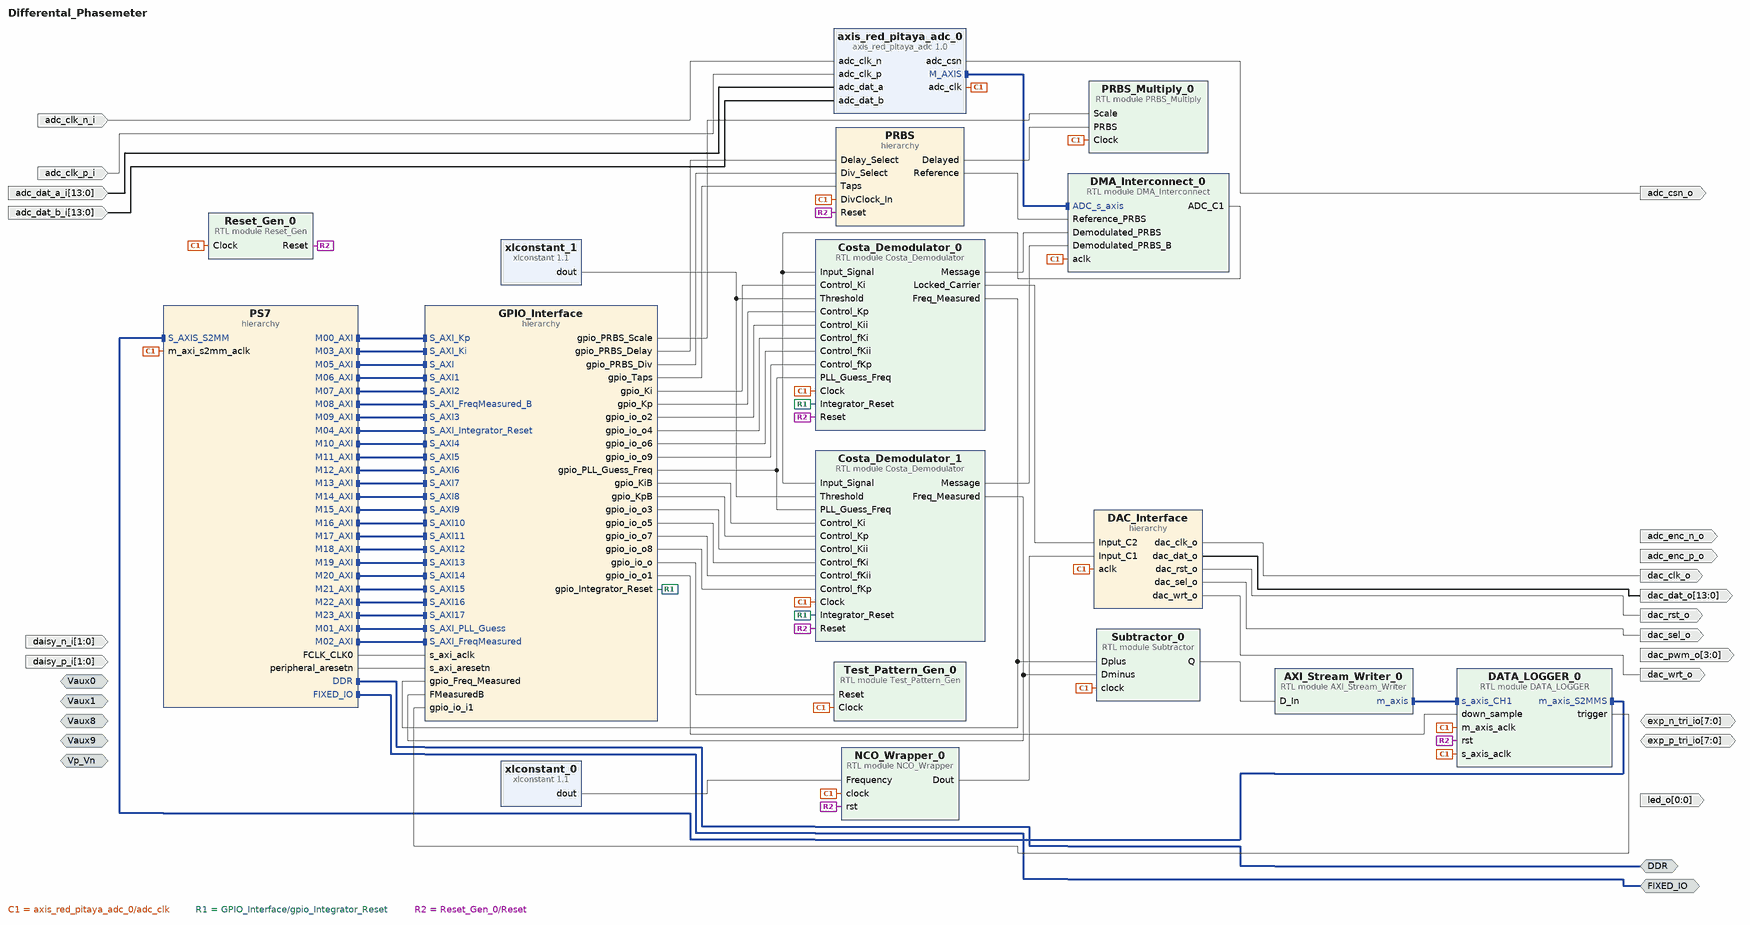
[diagram p0: block diagram of the top level]
# Vivado block design Differental_Phasemeter, xc7z010clg400-1, Vivado 2022.2
create_bd_design Differental_Phasemeter

create_bd_intf_port -mode Slave -vlnv xilinx.com:interface:diff_analog_io_rtl:1.0 Vaux0
create_bd_intf_port -mode Slave -vlnv xilinx.com:interface:diff_analog_io_rtl:1.0 Vaux1
create_bd_intf_port -mode Slave -vlnv xilinx.com:interface:diff_analog_io_rtl:1.0 Vaux8
create_bd_intf_port -mode Slave -vlnv xilinx.com:interface:diff_analog_io_rtl:1.0 Vaux9
create_bd_intf_port -mode Slave -vlnv xilinx.com:interface:diff_analog_io_rtl:1.0 Vp_Vn
create_bd_intf_port -mode Master -vlnv xilinx.com:interface:ddrx_rtl:1.0 DDR
create_bd_intf_port -mode Master -vlnv xilinx.com:display_processing_system7:fixedio_rtl:1.0 FIXED_IO
create_bd_port -dir I adc_clk_n_i
create_bd_port -dir I adc_clk_p_i
create_bd_port -dir I -from 13 -to 0 adc_dat_a_i
create_bd_port -dir I -from 13 -to 0 adc_dat_b_i
create_bd_port -dir I -from 1 -to 0 daisy_n_i
create_bd_port -dir I -from 1 -to 0 daisy_p_i
create_bd_port -dir O adc_csn_o
create_bd_port -dir O adc_enc_n_o
create_bd_port -dir O adc_enc_p_o
create_bd_port -dir O -from 3 -to 0 dac_pwm_o
create_bd_port -dir IO -from 7 -to 0 exp_n_tri_io
create_bd_port -dir IO -from 7 -to 0 exp_p_tri_io
create_bd_port -dir O -from 0 -to 0 led_o
create_bd_port -dir O dac_clk_o
create_bd_port -dir O -from 13 -to 0 dac_dat_o
create_bd_port -dir O dac_rst_o
create_bd_port -dir O dac_sel_o
create_bd_port -dir O dac_wrt_o

create_bd_cell -type ip -vlnv pavel-demin:user:axis_red_pitaya_adc:1.0 axis_red_pitaya_adc_0
create_bd_cell -type hier DAC_Interface
create_bd_cell -type hier GPIO_Interface
create_bd_cell -type hier PS7
create_bd_cell -type hier PRBS
create_bd_cell -type module -reference DMA_Interconnect DMA_Interconnect_0
create_bd_cell -type module -reference AXI_Stream_Writer AXI_Stream_Writer_0
create_bd_cell -type module -reference PRBS_Multiply PRBS_Multiply_0
create_bd_cell -type module -reference Reset_Gen Reset_Gen_0
create_bd_cell -type module -reference Test_Pattern_Gen Test_Pattern_Gen_0
create_bd_cell -type module -reference DATA_LOGGER DATA_LOGGER_0
set_property -dict {CONFIG.DMA_BUFFER 36864 CONFIG.VAR_DS 1} [get_bd_cells DATA_LOGGER_0]
create_bd_cell -type ip -vlnv xilinx.com:ip:xlconstant:1.1 xlconstant_0
set_property -dict {CONFIG.CONST_VAL 343597384 CONFIG.CONST_WIDTH 32} [get_bd_cells xlconstant_0]
create_bd_cell -type ip -vlnv xilinx.com:ip:xlconstant:1.1 xlconstant_1
set_property -dict {CONFIG.CONST_VAL 1 CONFIG.CONST_WIDTH 26} [get_bd_cells xlconstant_1]
create_bd_cell -type module -reference Costa_Demodulator Costa_Demodulator_0
set_property -dict {CONFIG.RAM_Size 14} [get_bd_cells Costa_Demodulator_0]
create_bd_cell -type module -reference Costa_Demodulator Costa_Demodulator_1
set_property -dict {CONFIG.RAM_Size 14} [get_bd_cells Costa_Demodulator_1]
create_bd_cell -type module -reference Subtractor Subtractor_0
create_bd_cell -type module -reference NCO_Wrapper NCO_Wrapper_0
set_property -dict {CONFIG.DAC_SIZE 14 CONFIG.ROM_Size 12} [get_bd_cells NCO_Wrapper_0]

# ---- hierarchy /DAC_Interface ----
current_bd_instance /DAC_Interface
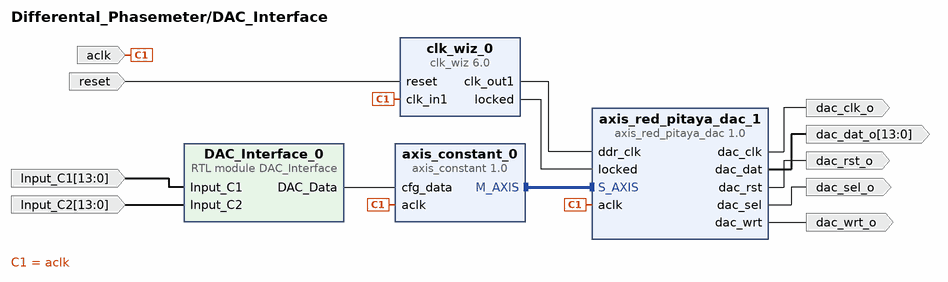
[diagram p1: block diagram inside /DAC_Interface]
create_bd_pin -dir I -type clk aclk
create_bd_pin -dir I -type rst reset
create_bd_pin -dir O -type clk dac_clk_o
create_bd_pin -dir O -type rst dac_rst_o
create_bd_pin -dir O dac_sel_o
create_bd_pin -dir O dac_wrt_o
create_bd_pin -dir O -from 13 -to 0 dac_dat_o
create_bd_pin -dir I -from 13 -to 0 Input_C2
create_bd_pin -dir I -from 13 -to 0 Input_C1

create_bd_cell -type ip -vlnv pavel-demin:user:axis_constant:1.0 axis_constant_0
set_property -dict {CONFIG.AXIS_TDATA_WIDTH 32} [get_bd_cells axis_constant_0]
create_bd_cell -type ip -vlnv xilinx.com:ip:clk_wiz:6.0 clk_wiz_0
set_property -dict [list \
  CONFIG.CLKOUT1_JITTER 104.759 \
  CONFIG.CLKOUT1_REQUESTED_OUT_FREQ 250 \
  CONFIG.MMCM_CLKOUT0_DIVIDE_F 4.000 \
] [get_bd_cells clk_wiz_0]
create_bd_cell -type ip -vlnv pavel-demin:user:axis_red_pitaya_dac:1.0 axis_red_pitaya_dac_1
create_bd_cell -type module -reference DAC_Interface DAC_Interface_0

# ---- hierarchy /GPIO_Interface ----
current_bd_instance /GPIO_Interface
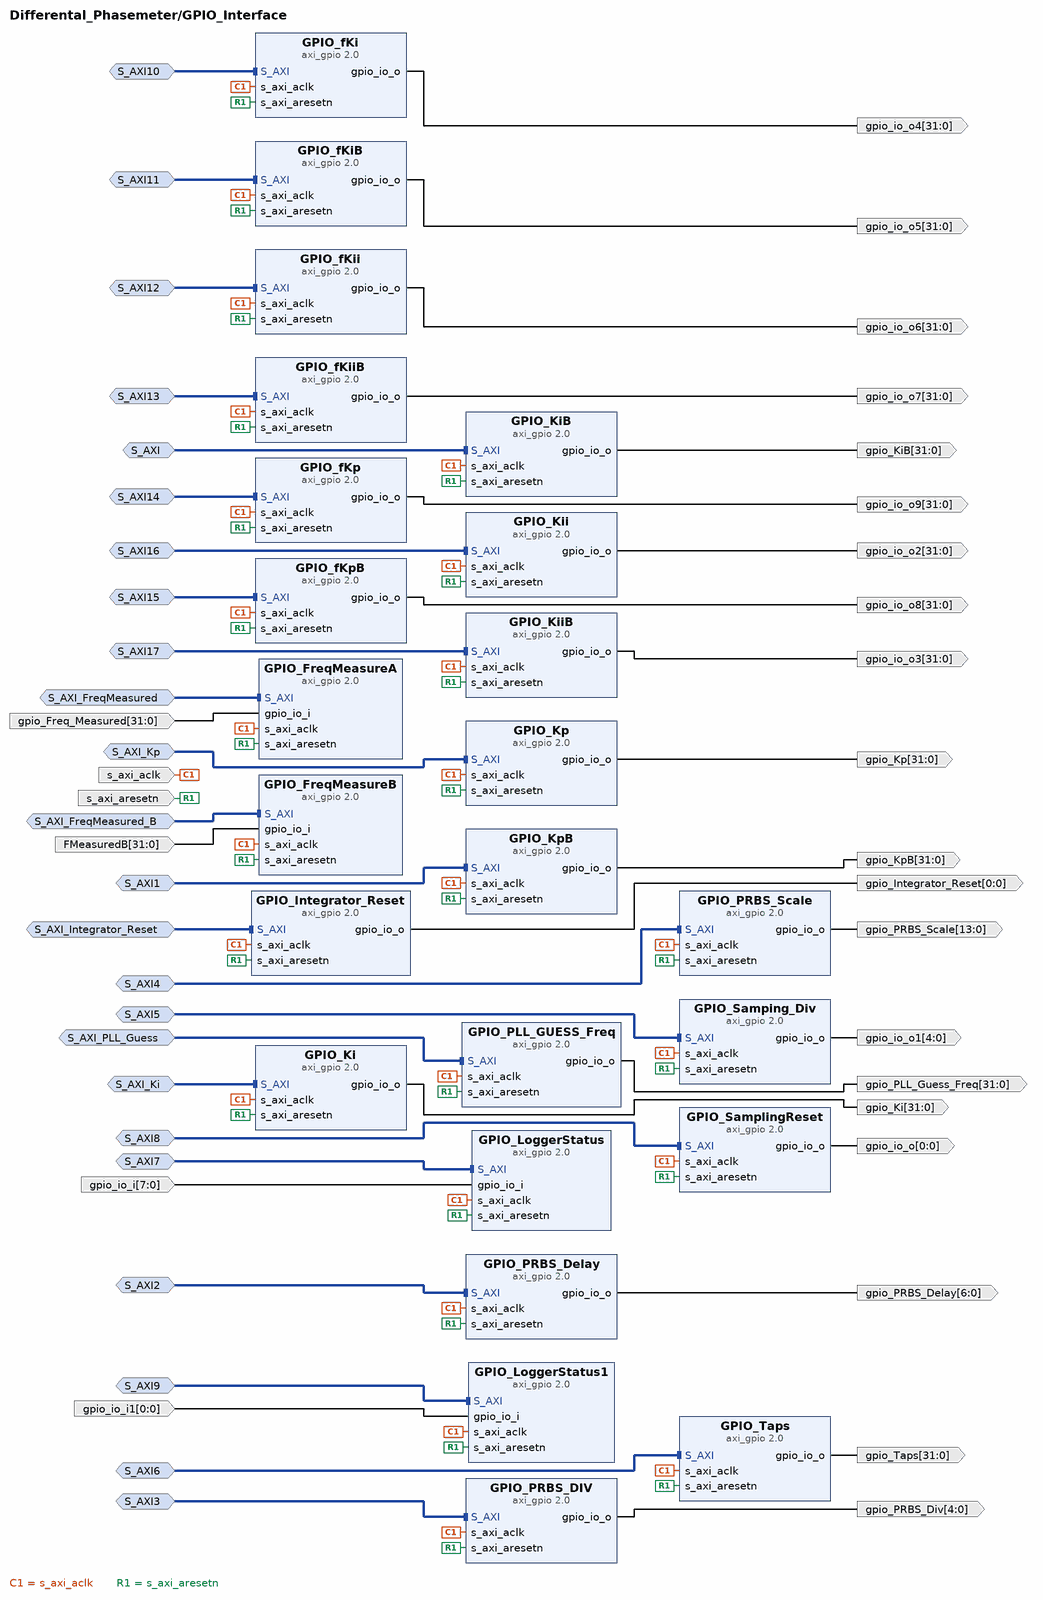
[diagram p2: block diagram inside /GPIO_Interface]
create_bd_intf_pin -mode Slave -vlnv xilinx.com:interface:aximm_rtl:1.0 S_AXI_Ki
create_bd_intf_pin -mode Slave -vlnv xilinx.com:interface:aximm_rtl:1.0 S_AXI_Kp
create_bd_intf_pin -mode Slave -vlnv xilinx.com:interface:aximm_rtl:1.0 S_AXI_PLL_Guess
create_bd_intf_pin -mode Slave -vlnv xilinx.com:interface:aximm_rtl:1.0 S_AXI_FreqMeasured
create_bd_intf_pin -mode Slave -vlnv xilinx.com:interface:aximm_rtl:1.0 S_AXI_Integrator_Reset
create_bd_intf_pin -mode Slave -vlnv xilinx.com:interface:aximm_rtl:1.0 S_AXI_FreqMeasured_B
create_bd_intf_pin -mode Slave -vlnv xilinx.com:interface:aximm_rtl:1.0 S_AXI
create_bd_intf_pin -mode Slave -vlnv xilinx.com:interface:aximm_rtl:1.0 S_AXI1
create_bd_intf_pin -mode Slave -vlnv xilinx.com:interface:aximm_rtl:1.0 S_AXI2
create_bd_intf_pin -mode Slave -vlnv xilinx.com:interface:aximm_rtl:1.0 S_AXI3
create_bd_intf_pin -mode Slave -vlnv xilinx.com:interface:aximm_rtl:1.0 S_AXI4
create_bd_intf_pin -mode Slave -vlnv xilinx.com:interface:aximm_rtl:1.0 S_AXI5
create_bd_intf_pin -mode Slave -vlnv xilinx.com:interface:aximm_rtl:1.0 S_AXI6
create_bd_intf_pin -mode Slave -vlnv xilinx.com:interface:aximm_rtl:1.0 S_AXI7
create_bd_intf_pin -mode Slave -vlnv xilinx.com:interface:aximm_rtl:1.0 S_AXI8
create_bd_intf_pin -mode Slave -vlnv xilinx.com:interface:aximm_rtl:1.0 S_AXI9
create_bd_intf_pin -mode Slave -vlnv xilinx.com:interface:aximm_rtl:1.0 S_AXI10
create_bd_intf_pin -mode Slave -vlnv xilinx.com:interface:aximm_rtl:1.0 S_AXI11
create_bd_intf_pin -mode Slave -vlnv xilinx.com:interface:aximm_rtl:1.0 S_AXI12
create_bd_intf_pin -mode Slave -vlnv xilinx.com:interface:aximm_rtl:1.0 S_AXI13
create_bd_intf_pin -mode Slave -vlnv xilinx.com:interface:aximm_rtl:1.0 S_AXI14
create_bd_intf_pin -mode Slave -vlnv xilinx.com:interface:aximm_rtl:1.0 S_AXI15
create_bd_intf_pin -mode Slave -vlnv xilinx.com:interface:aximm_rtl:1.0 S_AXI16
create_bd_intf_pin -mode Slave -vlnv xilinx.com:interface:aximm_rtl:1.0 S_AXI17
create_bd_pin -dir O -from 31 -to 0 gpio_Ki
create_bd_pin -dir O -from 31 -to 0 gpio_Kp
create_bd_pin -dir O -from 31 -to 0 gpio_PLL_Guess_Freq
create_bd_pin -dir I -type clk s_axi_aclk
create_bd_pin -dir I -type rst s_axi_aresetn
create_bd_pin -dir I -from 31 -to 0 gpio_Freq_Measured
create_bd_pin -dir O -from 0 -to 0 gpio_Integrator_Reset
create_bd_pin -dir I -from 31 -to 0 FMeasuredB
create_bd_pin -dir O -from 31 -to 0 gpio_KiB
create_bd_pin -dir O -from 31 -to 0 gpio_KpB
create_bd_pin -dir O -from 13 -to 0 gpio_PRBS_Scale
create_bd_pin -dir O -from 6 -to 0 gpio_PRBS_Delay
create_bd_pin -dir O -from 4 -to 0 gpio_PRBS_Div
create_bd_pin -dir O -from 31 -to 0 gpio_Taps
create_bd_pin -dir O -from 0 -to 0 gpio_io_o
create_bd_pin -dir O -from 4 -to 0 gpio_io_o1
create_bd_pin -dir I -from 7 -to 0 gpio_io_i
create_bd_pin -dir I -from 0 -to 0 gpio_io_i1
create_bd_pin -dir O -from 31 -to 0 gpio_io_o2
create_bd_pin -dir O -from 31 -to 0 gpio_io_o3
create_bd_pin -dir O -from 31 -to 0 gpio_io_o4
create_bd_pin -dir O -from 31 -to 0 gpio_io_o5
create_bd_pin -dir O -from 31 -to 0 gpio_io_o6
create_bd_pin -dir O -from 31 -to 0 gpio_io_o7
create_bd_pin -dir O -from 31 -to 0 gpio_io_o8
create_bd_pin -dir O -from 31 -to 0 gpio_io_o9

create_bd_cell -type ip -vlnv xilinx.com:ip:axi_gpio:2.0 GPIO_Ki
set_property -dict {CONFIG.C_ALL_OUTPUTS 1} [get_bd_cells GPIO_Ki]
create_bd_cell -type ip -vlnv xilinx.com:ip:axi_gpio:2.0 GPIO_Kp
set_property -dict {CONFIG.C_ALL_OUTPUTS 1} [get_bd_cells GPIO_Kp]
create_bd_cell -type ip -vlnv xilinx.com:ip:axi_gpio:2.0 GPIO_PLL_GUESS_Freq
set_property -dict {CONFIG.C_ALL_OUTPUTS 1} [get_bd_cells GPIO_PLL_GUESS_Freq]
create_bd_cell -type ip -vlnv xilinx.com:ip:axi_gpio:2.0 GPIO_FreqMeasureA
set_property -dict {CONFIG.C_ALL_INPUTS 1} [get_bd_cells GPIO_FreqMeasureA]
create_bd_cell -type ip -vlnv xilinx.com:ip:axi_gpio:2.0 GPIO_Integrator_Reset
set_property -dict {CONFIG.C_ALL_OUTPUTS 1 CONFIG.C_GPIO_WIDTH 1} [get_bd_cells GPIO_Integrator_Reset]
create_bd_cell -type ip -vlnv xilinx.com:ip:axi_gpio:2.0 GPIO_FreqMeasureB
set_property -dict {CONFIG.C_ALL_INPUTS 1} [get_bd_cells GPIO_FreqMeasureB]
create_bd_cell -type ip -vlnv xilinx.com:ip:axi_gpio:2.0 GPIO_KiB
set_property -dict {CONFIG.C_ALL_OUTPUTS 1} [get_bd_cells GPIO_KiB]
create_bd_cell -type ip -vlnv xilinx.com:ip:axi_gpio:2.0 GPIO_KpB
set_property -dict {CONFIG.C_ALL_OUTPUTS 1} [get_bd_cells GPIO_KpB]
create_bd_cell -type ip -vlnv xilinx.com:ip:axi_gpio:2.0 GPIO_PRBS_Scale
set_property -dict {CONFIG.C_ALL_OUTPUTS 1 CONFIG.C_GPIO_WIDTH 14} [get_bd_cells GPIO_PRBS_Scale]
create_bd_cell -type ip -vlnv xilinx.com:ip:axi_gpio:2.0 GPIO_PRBS_DIV
set_property -dict {CONFIG.C_ALL_OUTPUTS 1 CONFIG.C_GPIO_WIDTH 5} [get_bd_cells GPIO_PRBS_DIV]
create_bd_cell -type ip -vlnv xilinx.com:ip:axi_gpio:2.0 GPIO_PRBS_Delay
set_property -dict {CONFIG.C_ALL_OUTPUTS 1 CONFIG.C_GPIO_WIDTH 7} [get_bd_cells GPIO_PRBS_Delay]
create_bd_cell -type ip -vlnv xilinx.com:ip:axi_gpio:2.0 GPIO_Samping_Div
set_property -dict {CONFIG.C_ALL_OUTPUTS 1 CONFIG.C_GPIO_WIDTH 5} [get_bd_cells GPIO_Samping_Div]
create_bd_cell -type ip -vlnv xilinx.com:ip:axi_gpio:2.0 GPIO_Taps
set_property -dict {CONFIG.C_ALL_OUTPUTS 1 CONFIG.C_GPIO_WIDTH 32} [get_bd_cells GPIO_Taps]
create_bd_cell -type ip -vlnv xilinx.com:ip:axi_gpio:2.0 GPIO_SamplingReset
set_property -dict {CONFIG.C_ALL_OUTPUTS 1 CONFIG.C_GPIO_WIDTH 1} [get_bd_cells GPIO_SamplingReset]
create_bd_cell -type ip -vlnv xilinx.com:ip:axi_gpio:2.0 GPIO_LoggerStatus
set_property -dict {CONFIG.C_ALL_INPUTS 1 CONFIG.C_GPIO_WIDTH 8} [get_bd_cells GPIO_LoggerStatus]
create_bd_cell -type ip -vlnv xilinx.com:ip:axi_gpio:2.0 GPIO_LoggerStatus1
set_property -dict {CONFIG.C_ALL_INPUTS 1 CONFIG.C_GPIO_WIDTH 1} [get_bd_cells GPIO_LoggerStatus1]
create_bd_cell -type ip -vlnv xilinx.com:ip:axi_gpio:2.0 GPIO_Kii
set_property -dict {CONFIG.C_ALL_OUTPUTS 1} [get_bd_cells GPIO_Kii]
create_bd_cell -type ip -vlnv xilinx.com:ip:axi_gpio:2.0 GPIO_fKp
set_property -dict {CONFIG.C_ALL_OUTPUTS 1} [get_bd_cells GPIO_fKp]
create_bd_cell -type ip -vlnv xilinx.com:ip:axi_gpio:2.0 GPIO_fKi
set_property -dict {CONFIG.C_ALL_OUTPUTS 1} [get_bd_cells GPIO_fKi]
create_bd_cell -type ip -vlnv xilinx.com:ip:axi_gpio:2.0 GPIO_fKii
set_property -dict {CONFIG.C_ALL_OUTPUTS 1} [get_bd_cells GPIO_fKii]
create_bd_cell -type ip -vlnv xilinx.com:ip:axi_gpio:2.0 GPIO_fKiiB
set_property -dict {CONFIG.C_ALL_OUTPUTS 1} [get_bd_cells GPIO_fKiiB]
create_bd_cell -type ip -vlnv xilinx.com:ip:axi_gpio:2.0 GPIO_fKiB
set_property -dict {CONFIG.C_ALL_OUTPUTS 1} [get_bd_cells GPIO_fKiB]
create_bd_cell -type ip -vlnv xilinx.com:ip:axi_gpio:2.0 GPIO_fKpB
set_property -dict {CONFIG.C_ALL_OUTPUTS 1} [get_bd_cells GPIO_fKpB]
create_bd_cell -type ip -vlnv xilinx.com:ip:axi_gpio:2.0 GPIO_KiiB
set_property -dict {CONFIG.C_ALL_OUTPUTS 1} [get_bd_cells GPIO_KiiB]

# ---- hierarchy /PS7 ----
current_bd_instance /PS7
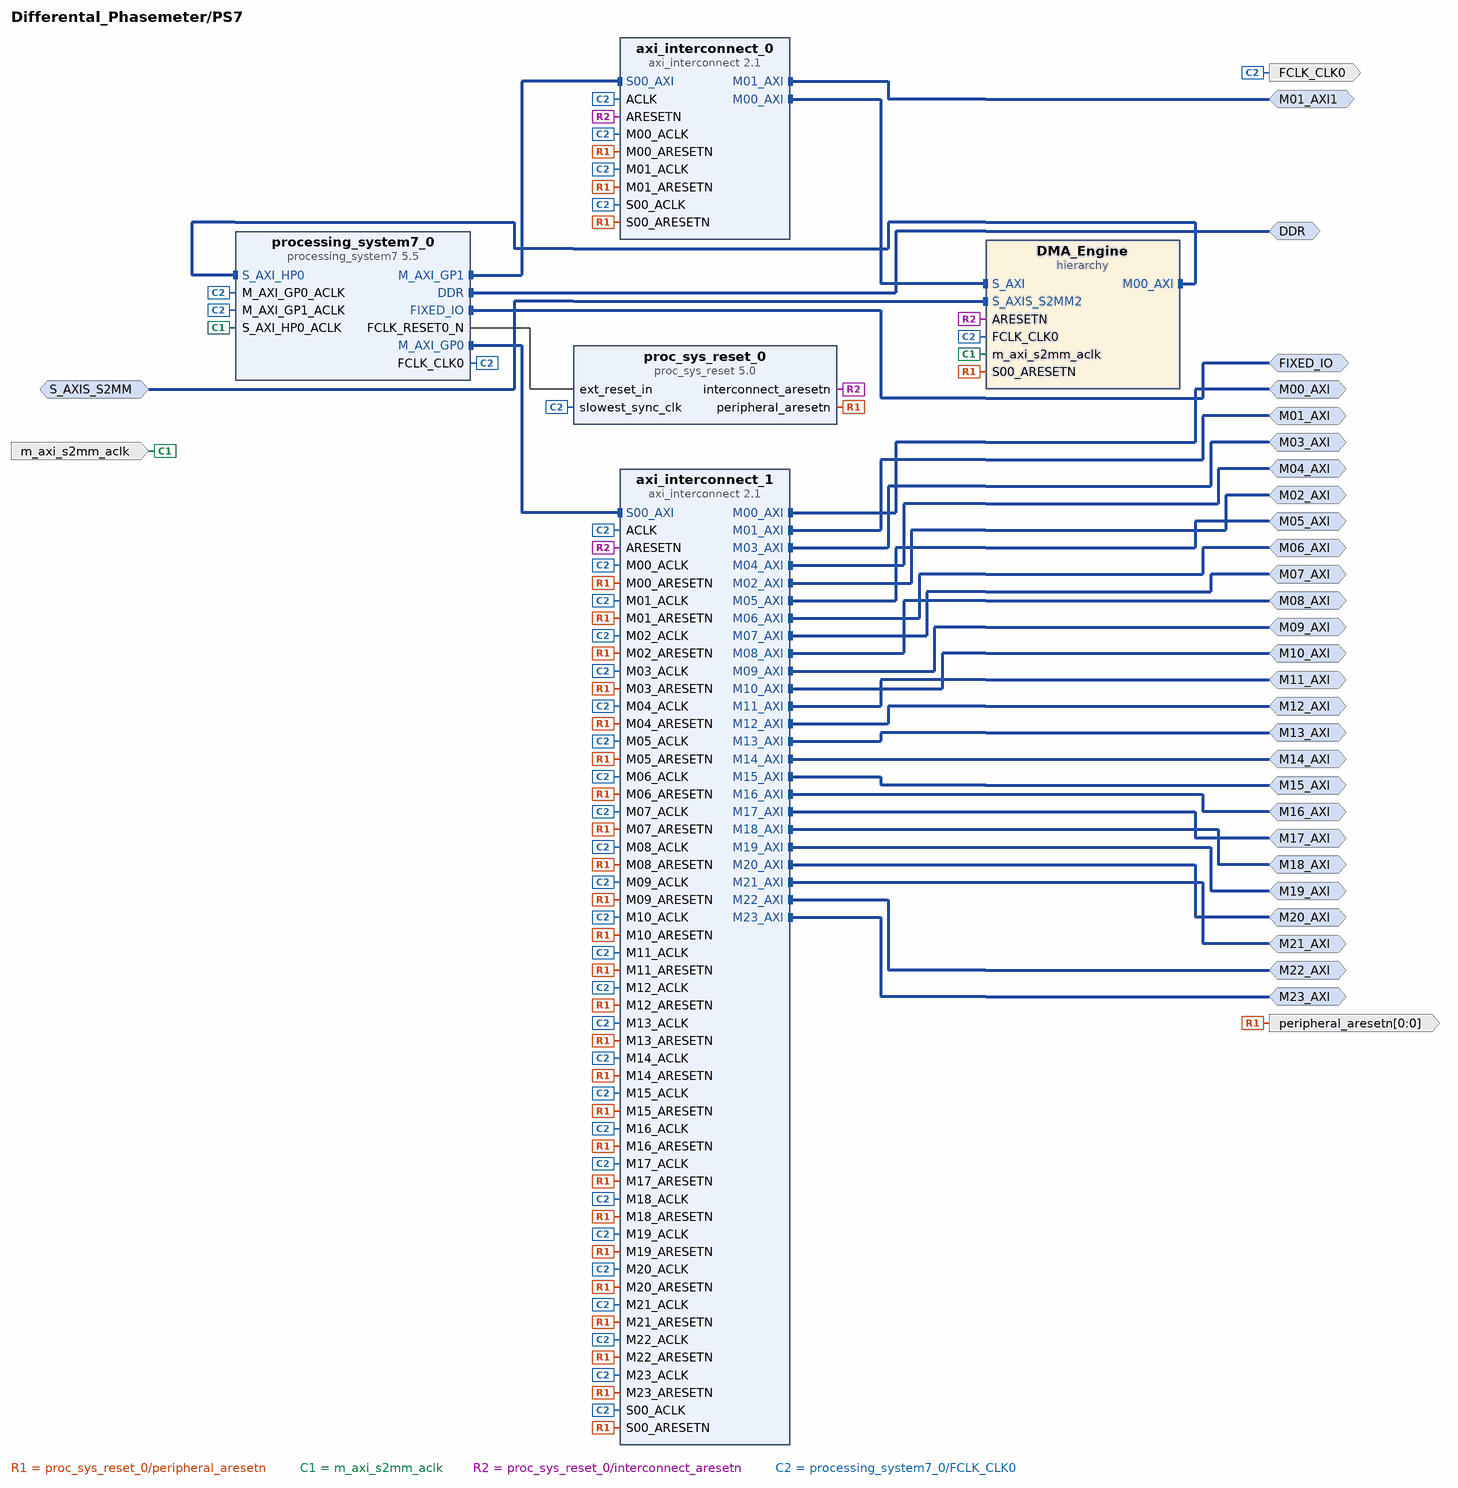
[diagram p3: block diagram inside /PS7]
create_bd_intf_pin -mode Master -vlnv xilinx.com:interface:ddrx_rtl:1.0 DDR
create_bd_intf_pin -mode Master -vlnv xilinx.com:display_processing_system7:fixedio_rtl:1.0 FIXED_IO
create_bd_intf_pin -mode Master -vlnv xilinx.com:interface:aximm_rtl:1.0 M03_AXI
create_bd_intf_pin -mode Master -vlnv xilinx.com:interface:aximm_rtl:1.0 M00_AXI
create_bd_intf_pin -mode Master -vlnv xilinx.com:interface:aximm_rtl:1.0 M01_AXI
create_bd_intf_pin -mode Master -vlnv xilinx.com:interface:aximm_rtl:1.0 M02_AXI
create_bd_intf_pin -mode Master -vlnv xilinx.com:interface:aximm_rtl:1.0 M04_AXI
create_bd_intf_pin -mode Master -vlnv xilinx.com:interface:aximm_rtl:1.0 M05_AXI
create_bd_intf_pin -mode Master -vlnv xilinx.com:interface:aximm_rtl:1.0 M06_AXI
create_bd_intf_pin -mode Master -vlnv xilinx.com:interface:aximm_rtl:1.0 M07_AXI
create_bd_intf_pin -mode Master -vlnv xilinx.com:interface:aximm_rtl:1.0 M08_AXI
create_bd_intf_pin -mode Master -vlnv xilinx.com:interface:aximm_rtl:1.0 M09_AXI
create_bd_intf_pin -mode Master -vlnv xilinx.com:interface:aximm_rtl:1.0 M10_AXI
create_bd_intf_pin -mode Master -vlnv xilinx.com:interface:aximm_rtl:1.0 M11_AXI
create_bd_intf_pin -mode Master -vlnv xilinx.com:interface:aximm_rtl:1.0 M12_AXI
create_bd_intf_pin -mode Master -vlnv xilinx.com:interface:aximm_rtl:1.0 M13_AXI
create_bd_intf_pin -mode Master -vlnv xilinx.com:interface:aximm_rtl:1.0 M14_AXI
create_bd_intf_pin -mode Master -vlnv xilinx.com:interface:aximm_rtl:1.0 M01_AXI1
create_bd_intf_pin -mode Slave -vlnv xilinx.com:interface:axis_rtl:1.0 S_AXIS_S2MM
create_bd_intf_pin -mode Master -vlnv xilinx.com:interface:aximm_rtl:1.0 M15_AXI
create_bd_intf_pin -mode Master -vlnv xilinx.com:interface:aximm_rtl:1.0 M16_AXI
create_bd_intf_pin -mode Master -vlnv xilinx.com:interface:aximm_rtl:1.0 M17_AXI
create_bd_intf_pin -mode Master -vlnv xilinx.com:interface:aximm_rtl:1.0 M18_AXI
create_bd_intf_pin -mode Master -vlnv xilinx.com:interface:aximm_rtl:1.0 M19_AXI
create_bd_intf_pin -mode Master -vlnv xilinx.com:interface:aximm_rtl:1.0 M20_AXI
create_bd_intf_pin -mode Master -vlnv xilinx.com:interface:aximm_rtl:1.0 M21_AXI
create_bd_intf_pin -mode Master -vlnv xilinx.com:interface:aximm_rtl:1.0 M22_AXI
create_bd_intf_pin -mode Master -vlnv xilinx.com:interface:aximm_rtl:1.0 M23_AXI
create_bd_pin -dir O -type clk FCLK_CLK0
create_bd_pin -dir O -from 0 -to 0 -type rst peripheral_aresetn
create_bd_pin -dir I -type clk m_axi_s2mm_aclk

create_bd_cell -type ip -vlnv xilinx.com:ip:processing_system7:5.5 processing_system7_0
set_property -dict [list \
  CONFIG.PCW_APU_PERIPHERAL_FREQMHZ 666.666666 \
  CONFIG.PCW_ENET0_ENET0_IO {MIO 16 .. 27} \
  CONFIG.PCW_ENET0_GRP_MDIO_ENABLE 1 \
  CONFIG.PCW_ENET0_GRP_MDIO_IO EMIO \
  CONFIG.PCW_ENET0_PERIPHERAL_ENABLE 1 \
  CONFIG.PCW_ENET0_RESET_ENABLE 0 \
  CONFIG.PCW_ENET_RESET_ENABLE 1 \
  CONFIG.PCW_ENET_RESET_SELECT {Share reset pin} \
  CONFIG.PCW_EN_CLK1_PORT 1 \
  CONFIG.PCW_EN_RST1_PORT 1 \
  CONFIG.PCW_FCLK1_PERIPHERAL_CLKSRC {DDR PLL} \
  CONFIG.PCW_FCLK_CLK1_BUF TRUE \
  CONFIG.PCW_FPGA0_PERIPHERAL_FREQMHZ 125 \
  CONFIG.PCW_FPGA1_PERIPHERAL_FREQMHZ 150 \
  CONFIG.PCW_FPGA3_PERIPHERAL_FREQMHZ 200 \
  CONFIG.PCW_FPGA_FCLK1_ENABLE 1 \
  CONFIG.PCW_GPIO_MIO_GPIO_ENABLE 1 \
  CONFIG.PCW_GPIO_MIO_GPIO_IO MIO \
  CONFIG.PCW_GPIO_PERIPHERAL_ENABLE 1 \
  CONFIG.PCW_I2C0_GRP_INT_ENABLE 0 \
  CONFIG.PCW_I2C0_I2C0_IO {MIO 50 .. 51} \
  CONFIG.PCW_I2C0_PERIPHERAL_ENABLE 1 \
  CONFIG.PCW_I2C_PERIPHERAL_FREQMHZ 111.111115 \
  CONFIG.PCW_I2C_RESET_ENABLE 1 \
  CONFIG.PCW_I2C_RESET_SELECT {Share reset pin} \
  CONFIG.PCW_IMPORT_BOARD_PRESET cfg/red_pitaya.xml \
  CONFIG.PCW_PERIPHERAL_BOARD_PRESET None \
  CONFIG.PCW_PRESET_BANK1_VOLTAGE {LVCMOS 2.5V} \
  CONFIG.PCW_QSPI_GRP_SINGLE_SS_ENABLE 1 \
  CONFIG.PCW_QSPI_GRP_SINGLE_SS_IO {MIO 1 .. 6} \
  CONFIG.PCW_QSPI_PERIPHERAL_ENABLE 1 \
  CONFIG.PCW_QSPI_PERIPHERAL_FREQMHZ 125 \
  CONFIG.PCW_QSPI_QSPI_IO {MIO 1 .. 6} \
  CONFIG.PCW_SD0_GRP_CD_ENABLE 1 \
  CONFIG.PCW_SD0_GRP_CD_IO {MIO 46} \
  CONFIG.PCW_SD0_GRP_WP_ENABLE 1 \
  CONFIG.PCW_SD0_GRP_WP_IO {MIO 47} \
  CONFIG.PCW_SD0_PERIPHERAL_ENABLE 1 \
  CONFIG.PCW_SD0_SD0_IO {MIO 40 .. 45} \
  CONFIG.PCW_SDIO_PERIPHERAL_FREQMHZ 100 \
  CONFIG.PCW_SINGLE_QSPI_DATA_MODE x4 \
  CONFIG.PCW_SPI0_PERIPHERAL_ENABLE 1 \
  CONFIG.PCW_SPI0_SPI0_IO EMIO \
  CONFIG.PCW_SPI1_PERIPHERAL_ENABLE 1 \
  CONFIG.PCW_SPI1_SPI1_IO {MIO 10 .. 15} \
  CONFIG.PCW_S_AXI_HP0_DATA_WIDTH 32 \
  CONFIG.PCW_TTC0_PERIPHERAL_ENABLE 1 \
  CONFIG.PCW_TTC0_TTC0_IO EMIO \
  CONFIG.PCW_UART0_PERIPHERAL_ENABLE 1 \
  CONFIG.PCW_UART0_UART0_IO {MIO 14 .. 15} \
  CONFIG.PCW_UART1_PERIPHERAL_ENABLE 1 \
  CONFIG.PCW_UART1_UART1_IO {MIO 8 .. 9} \
  CONFIG.PCW_UART_PERIPHERAL_FREQMHZ 100 \
  CONFIG.PCW_UIPARAM_DDR_BUS_WIDTH {16 Bit} \
  CONFIG.PCW_UIPARAM_DDR_FREQ_MHZ 533.333333 \
  CONFIG.PCW_UIPARAM_DDR_PARTNO {MT41J256M16 RE-125} \
  CONFIG.PCW_USB0_PERIPHERAL_ENABLE 1 \
  CONFIG.PCW_USB0_RESET_ENABLE 1 \
  CONFIG.PCW_USB0_RESET_IO {MIO 48} \
  CONFIG.PCW_USB0_USB0_IO {MIO 28 .. 39} \
  CONFIG.PCW_USB_RESET_ENABLE 1 \
  CONFIG.PCW_USB_RESET_SELECT {Share reset pin} \
  CONFIG.PCW_USE_M_AXI_GP1 1 \
  CONFIG.PCW_USE_S_AXI_HP0 1 \
] [get_bd_cells processing_system7_0]
# 512 more settings of processing_system7_0 are not shown: defaults, MIO pin electricals, DDR timing, and values the tool derives
create_bd_cell -type ip -vlnv xilinx.com:ip:proc_sys_reset:5.0 proc_sys_reset_0
create_bd_cell -type ip -vlnv xilinx.com:ip:axi_interconnect:2.1 axi_interconnect_1
set_property -dict {CONFIG.NUM_MI 24 CONFIG.NUM_SI 1} [get_bd_cells axi_interconnect_1]
create_bd_cell -type hier DMA_Engine
create_bd_cell -type ip -vlnv xilinx.com:ip:axi_interconnect:2.1 axi_interconnect_0
set_property -dict {CONFIG.NUM_MI 2 CONFIG.NUM_SI 1} [get_bd_cells axi_interconnect_0]

# ---- hierarchy /PS7/DMA_Engine ----
current_bd_instance /PS7/DMA_Engine
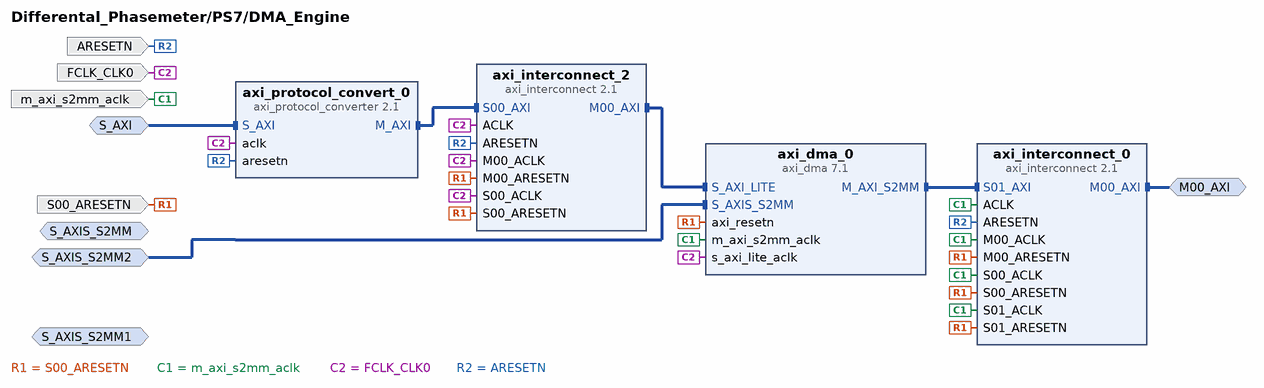
[diagram p4: block diagram inside /PS7/DMA_Engine]
create_bd_intf_pin -mode Slave -vlnv xilinx.com:interface:aximm_rtl:1.0 S_AXI
create_bd_intf_pin -mode Master -vlnv xilinx.com:interface:aximm_rtl:1.0 M00_AXI
create_bd_intf_pin -mode Slave -vlnv xilinx.com:interface:axis_rtl:1.0 S_AXIS_S2MM
create_bd_intf_pin -mode Slave -vlnv xilinx.com:interface:axis_rtl:1.0 S_AXIS_S2MM1
create_bd_intf_pin -mode Slave -vlnv xilinx.com:interface:axis_rtl:1.0 S_AXIS_S2MM2
create_bd_pin -dir I -type clk FCLK_CLK0
create_bd_pin -dir I -type clk m_axi_s2mm_aclk
create_bd_pin -dir I -type rst S00_ARESETN
create_bd_pin -dir I -type rst ARESETN

create_bd_cell -type ip -vlnv xilinx.com:ip:axi_dma:7.1 axi_dma_0
set_property -dict [list \
  CONFIG.c_include_mm2s 0 \
  CONFIG.c_include_sg 0 \
  CONFIG.c_s2mm_burst_size 256 \
  CONFIG.c_sg_length_width 20 \
] [get_bd_cells axi_dma_0]
create_bd_cell -type ip -vlnv xilinx.com:ip:axi_protocol_converter:2.1 axi_protocol_convert_0
create_bd_cell -type ip -vlnv xilinx.com:ip:axi_interconnect:2.1 axi_interconnect_2
set_property -dict {CONFIG.NUM_MI 1} [get_bd_cells axi_interconnect_2]
create_bd_cell -type ip -vlnv xilinx.com:ip:axi_interconnect:2.1 axi_interconnect_0
set_property -dict {CONFIG.NUM_MI 1 CONFIG.NUM_SI 2} [get_bd_cells axi_interconnect_0]

# ---- hierarchy /PRBS ----
current_bd_instance /PRBS
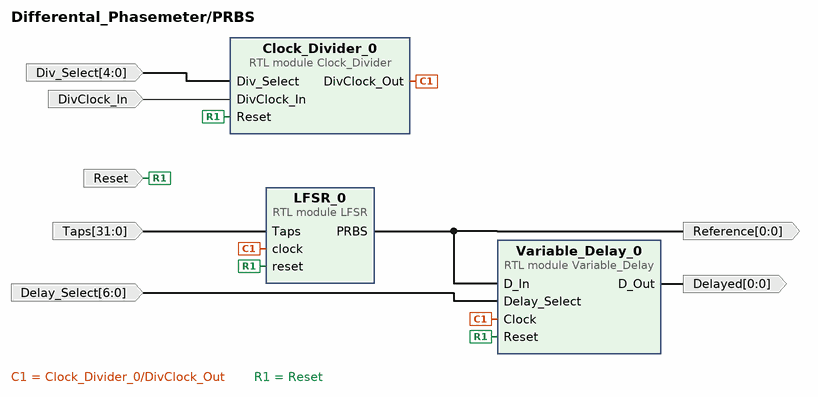
[diagram p5: block diagram inside /PRBS]
create_bd_pin -dir I -from 31 -to 0 Taps
create_bd_pin -dir O -from 0 -to 0 Reference
create_bd_pin -dir I -type rst Reset
create_bd_pin -dir I DivClock_In
create_bd_pin -dir O -from 0 -to 0 Delayed
create_bd_pin -dir I -from 6 -to 0 Delay_Select
create_bd_pin -dir I -from 4 -to 0 Div_Select

create_bd_cell -type module -reference LFSR LFSR_0
set_property -dict {CONFIG.Size 8} [get_bd_cells LFSR_0]
create_bd_cell -type module -reference Clock_Divider Clock_Divider_0
create_bd_cell -type module -reference Variable_Delay Variable_Delay_0
set_property -dict {CONFIG.Bus_Size 1 CONFIG.Delay_Select_Bits 7} [get_bd_cells Variable_Delay_0]

# ---- connections ----

current_bd_instance /DAC_Interface
connect_bd_intf_net [get_bd_intf_pins axis_red_pitaya_dac_1/S_AXIS] [get_bd_intf_pins axis_constant_0/M_AXIS]
connect_bd_net -net Custom_System_0_Reset [get_bd_pins reset] [get_bd_pins clk_wiz_0/reset]
connect_bd_net [get_bd_pins DAC_Interface_0/DAC_Data] [get_bd_pins axis_constant_0/cfg_data]
connect_bd_net -net Input_C1_1 [get_bd_pins Input_C1] [get_bd_pins DAC_Interface_0/Input_C1]
connect_bd_net -net Input_C2_1 [get_bd_pins Input_C2] [get_bd_pins DAC_Interface_0/Input_C2]
connect_bd_net [get_bd_pins aclk] [get_bd_pins axis_red_pitaya_dac_1/aclk] [get_bd_pins clk_wiz_0/clk_in1] [get_bd_pins axis_constant_0/aclk]
connect_bd_net [get_bd_pins axis_red_pitaya_dac_1/dac_clk] [get_bd_pins dac_clk_o]
connect_bd_net [get_bd_pins axis_red_pitaya_dac_1/dac_dat] [get_bd_pins dac_dat_o]
connect_bd_net [get_bd_pins axis_red_pitaya_dac_1/dac_rst] [get_bd_pins dac_rst_o]
connect_bd_net [get_bd_pins axis_red_pitaya_dac_1/dac_sel] [get_bd_pins dac_sel_o]
connect_bd_net [get_bd_pins axis_red_pitaya_dac_1/dac_wrt] [get_bd_pins dac_wrt_o]
connect_bd_net [get_bd_pins clk_wiz_0/clk_out1] [get_bd_pins axis_red_pitaya_dac_1/ddr_clk]
connect_bd_net [get_bd_pins clk_wiz_0/locked] [get_bd_pins axis_red_pitaya_dac_1/locked]

current_bd_instance /GPIO_Interface
connect_bd_intf_net [get_bd_intf_pins S_AXI_FreqMeasured_B] [get_bd_intf_pins GPIO_FreqMeasureB/S_AXI]
connect_bd_intf_net [get_bd_intf_pins S_AXI] [get_bd_intf_pins GPIO_KiB/S_AXI]
connect_bd_intf_net [get_bd_intf_pins S_AXI1] [get_bd_intf_pins GPIO_KpB/S_AXI]
connect_bd_intf_net [get_bd_intf_pins S_AXI2] [get_bd_intf_pins GPIO_PRBS_Delay/S_AXI]
connect_bd_intf_net [get_bd_intf_pins S_AXI3] [get_bd_intf_pins GPIO_PRBS_DIV/S_AXI]
connect_bd_intf_net -intf_net PS7_M00_AXI [get_bd_intf_pins S_AXI_PLL_Guess] [get_bd_intf_pins GPIO_PLL_GUESS_Freq/S_AXI]
connect_bd_intf_net -intf_net PS7_M04_AXI [get_bd_intf_pins S_AXI_Kp] [get_bd_intf_pins GPIO_Kp/S_AXI]
connect_bd_intf_net -intf_net PS7_M05_AXI [get_bd_intf_pins S_AXI_Ki] [get_bd_intf_pins GPIO_Ki/S_AXI]
connect_bd_intf_net -intf_net S_AXI10_1 [get_bd_intf_pins S_AXI_Integrator_Reset] [get_bd_intf_pins GPIO_Integrator_Reset/S_AXI]
connect_bd_intf_net -intf_net S_AXI10_2 [get_bd_intf_pins S_AXI10] [get_bd_intf_pins GPIO_fKi/S_AXI]
connect_bd_intf_net -intf_net S_AXI11_1 [get_bd_intf_pins S_AXI11] [get_bd_intf_pins GPIO_fKiB/S_AXI]
connect_bd_intf_net -intf_net S_AXI12_1 [get_bd_intf_pins S_AXI12] [get_bd_intf_pins GPIO_fKii/S_AXI]
connect_bd_intf_net -intf_net S_AXI13_1 [get_bd_intf_pins S_AXI13] [get_bd_intf_pins GPIO_fKiiB/S_AXI]
connect_bd_intf_net -intf_net S_AXI14_1 [get_bd_intf_pins S_AXI14] [get_bd_intf_pins GPIO_fKp/S_AXI]
connect_bd_intf_net -intf_net S_AXI15_1 [get_bd_intf_pins S_AXI15] [get_bd_intf_pins GPIO_fKpB/S_AXI]
connect_bd_intf_net -intf_net S_AXI16_1 [get_bd_intf_pins S_AXI16] [get_bd_intf_pins GPIO_Kii/S_AXI]
connect_bd_intf_net -intf_net S_AXI17_1 [get_bd_intf_pins S_AXI17] [get_bd_intf_pins GPIO_KiiB/S_AXI]
connect_bd_intf_net -intf_net S_AXI4_1 [get_bd_intf_pins S_AXI4] [get_bd_intf_pins GPIO_PRBS_Scale/S_AXI]
connect_bd_intf_net -intf_net S_AXI5_1 [get_bd_intf_pins S_AXI5] [get_bd_intf_pins GPIO_Samping_Div/S_AXI]
connect_bd_intf_net -intf_net S_AXI6_1 [get_bd_intf_pins S_AXI6] [get_bd_intf_pins GPIO_Taps/S_AXI]
connect_bd_intf_net -intf_net S_AXI7_1 [get_bd_intf_pins S_AXI_FreqMeasured] [get_bd_intf_pins GPIO_FreqMeasureA/S_AXI]
connect_bd_intf_net -intf_net S_AXI7_2 [get_bd_intf_pins S_AXI7] [get_bd_intf_pins GPIO_LoggerStatus/S_AXI]
connect_bd_intf_net -intf_net S_AXI8_1 [get_bd_intf_pins S_AXI8] [get_bd_intf_pins GPIO_SamplingReset/S_AXI]
connect_bd_intf_net -intf_net S_AXI9_1 [get_bd_intf_pins S_AXI9] [get_bd_intf_pins GPIO_LoggerStatus1/S_AXI]
connect_bd_net [get_bd_pins GPIO_Integrator_Reset/gpio_io_o] [get_bd_pins gpio_Integrator_Reset]
connect_bd_net [get_bd_pins GPIO_KiB/gpio_io_o] [get_bd_pins gpio_KiB]
connect_bd_net [get_bd_pins GPIO_Ki/gpio_io_o] [get_bd_pins gpio_Ki]
connect_bd_net [get_bd_pins GPIO_KiiB/gpio_io_o] [get_bd_pins gpio_io_o3]
connect_bd_net [get_bd_pins GPIO_Kii/gpio_io_o] [get_bd_pins gpio_io_o2]
connect_bd_net [get_bd_pins GPIO_KpB/gpio_io_o] [get_bd_pins gpio_KpB]
connect_bd_net [get_bd_pins GPIO_Kp/gpio_io_o] [get_bd_pins gpio_Kp]
connect_bd_net [get_bd_pins GPIO_PLL_GUESS_Freq/gpio_io_o] [get_bd_pins gpio_PLL_Guess_Freq]
connect_bd_net [get_bd_pins GPIO_PRBS_DIV/gpio_io_o] [get_bd_pins gpio_PRBS_Div]
connect_bd_net [get_bd_pins GPIO_PRBS_Delay/gpio_io_o] [get_bd_pins gpio_PRBS_Delay]
connect_bd_net [get_bd_pins GPIO_PRBS_Scale/gpio_io_o] [get_bd_pins gpio_PRBS_Scale]
connect_bd_net [get_bd_pins GPIO_Samping_Div/gpio_io_o] [get_bd_pins gpio_io_o1]
connect_bd_net [get_bd_pins GPIO_SamplingReset/gpio_io_o] [get_bd_pins gpio_io_o]
connect_bd_net [get_bd_pins GPIO_Taps/gpio_io_o] [get_bd_pins gpio_Taps]
connect_bd_net [get_bd_pins GPIO_fKiB/gpio_io_o] [get_bd_pins gpio_io_o5]
connect_bd_net [get_bd_pins GPIO_fKi/gpio_io_o] [get_bd_pins gpio_io_o4]
connect_bd_net [get_bd_pins GPIO_fKiiB/gpio_io_o] [get_bd_pins gpio_io_o7]
connect_bd_net [get_bd_pins GPIO_fKii/gpio_io_o] [get_bd_pins gpio_io_o6]
connect_bd_net [get_bd_pins GPIO_fKpB/gpio_io_o] [get_bd_pins gpio_io_o8]
connect_bd_net [get_bd_pins GPIO_fKp/gpio_io_o] [get_bd_pins gpio_io_o9]
connect_bd_net [get_bd_pins s_axi_aclk] \
  [get_bd_pins GPIO_Ki/s_axi_aclk] [get_bd_pins GPIO_Kp/s_axi_aclk] [get_bd_pins GPIO_PLL_GUESS_Freq/s_axi_aclk] \
  [get_bd_pins GPIO_FreqMeasureA/s_axi_aclk] [get_bd_pins GPIO_Integrator_Reset/s_axi_aclk] \
  [get_bd_pins GPIO_FreqMeasureB/s_axi_aclk] [get_bd_pins GPIO_KpB/s_axi_aclk] [get_bd_pins GPIO_KiB/s_axi_aclk] \
  [get_bd_pins GPIO_PRBS_Scale/s_axi_aclk] [get_bd_pins GPIO_PRBS_DIV/s_axi_aclk] [get_bd_pins GPIO_PRBS_Delay/s_axi_aclk] \
  [get_bd_pins GPIO_Samping_Div/s_axi_aclk] [get_bd_pins GPIO_Taps/s_axi_aclk] [get_bd_pins GPIO_LoggerStatus/s_axi_aclk] \
  [get_bd_pins GPIO_SamplingReset/s_axi_aclk] [get_bd_pins GPIO_LoggerStatus1/s_axi_aclk] [get_bd_pins GPIO_fKi/s_axi_aclk] \
  [get_bd_pins GPIO_fKiB/s_axi_aclk] [get_bd_pins GPIO_fKii/s_axi_aclk] [get_bd_pins GPIO_fKiiB/s_axi_aclk] \
  [get_bd_pins GPIO_fKp/s_axi_aclk] [get_bd_pins GPIO_fKpB/s_axi_aclk] [get_bd_pins GPIO_Kii/s_axi_aclk] \
  [get_bd_pins GPIO_KiiB/s_axi_aclk]
connect_bd_net [get_bd_pins s_axi_aresetn] \
  [get_bd_pins GPIO_PLL_GUESS_Freq/s_axi_aresetn] [get_bd_pins GPIO_Kp/s_axi_aresetn] [get_bd_pins GPIO_Ki/s_axi_aresetn] \
  [get_bd_pins GPIO_FreqMeasureA/s_axi_aresetn] [get_bd_pins GPIO_Integrator_Reset/s_axi_aresetn] \
  [get_bd_pins GPIO_FreqMeasureB/s_axi_aresetn] [get_bd_pins GPIO_KpB/s_axi_aresetn] [get_bd_pins GPIO_KiB/s_axi_aresetn] \
  [get_bd_pins GPIO_PRBS_Scale/s_axi_aresetn] [get_bd_pins GPIO_Samping_Div/s_axi_aresetn] \
  [get_bd_pins GPIO_PRBS_Delay/s_axi_aresetn] [get_bd_pins GPIO_PRBS_DIV/s_axi_aresetn] [get_bd_pins GPIO_Taps/s_axi_aresetn] \
  [get_bd_pins GPIO_LoggerStatus/s_axi_aresetn] [get_bd_pins GPIO_SamplingReset/s_axi_aresetn] \
  [get_bd_pins GPIO_LoggerStatus1/s_axi_aresetn] [get_bd_pins GPIO_fKi/s_axi_aresetn] [get_bd_pins GPIO_fKiB/s_axi_aresetn] \
  [get_bd_pins GPIO_fKii/s_axi_aresetn] [get_bd_pins GPIO_fKiiB/s_axi_aresetn] [get_bd_pins GPIO_fKp/s_axi_aresetn] \
  [get_bd_pins GPIO_fKpB/s_axi_aresetn] [get_bd_pins GPIO_Kii/s_axi_aresetn] [get_bd_pins GPIO_KiiB/s_axi_aresetn]
connect_bd_net -net gpio_io_i1_1 [get_bd_pins gpio_io_i1] [get_bd_pins GPIO_LoggerStatus1/gpio_io_i]
connect_bd_net -net gpio_io_i2_1 [get_bd_pins FMeasuredB] [get_bd_pins GPIO_FreqMeasureB/gpio_io_i]
connect_bd_net -net gpio_io_i_1 [get_bd_pins gpio_Freq_Measured] [get_bd_pins GPIO_FreqMeasureA/gpio_io_i]
connect_bd_net [get_bd_pins gpio_io_i] [get_bd_pins GPIO_LoggerStatus/gpio_io_i]

current_bd_instance /PS7
connect_bd_intf_net [get_bd_intf_pins M03_AXI] [get_bd_intf_pins axi_interconnect_1/M03_AXI]
connect_bd_intf_net [get_bd_intf_pins M04_AXI] [get_bd_intf_pins axi_interconnect_1/M04_AXI]
connect_bd_intf_net [get_bd_intf_pins M01_AXI1] [get_bd_intf_pins axi_interconnect_0/M01_AXI]
connect_bd_intf_net [get_bd_intf_pins M00_AXI] [get_bd_intf_pins axi_interconnect_1/M00_AXI]
connect_bd_intf_net [get_bd_intf_pins M01_AXI] [get_bd_intf_pins axi_interconnect_1/M01_AXI]
connect_bd_intf_net [get_bd_intf_pins M02_AXI] [get_bd_intf_pins axi_interconnect_1/M02_AXI]
connect_bd_intf_net [get_bd_intf_pins S_AXIS_S2MM] [get_bd_intf_pins DMA_Engine/S_AXIS_S2MM2]
connect_bd_intf_net [get_bd_intf_pins DMA_Engine/M00_AXI] [get_bd_intf_pins processing_system7_0/S_AXI_HP0]
connect_bd_intf_net [get_bd_intf_pins axi_interconnect_0/S00_AXI] [get_bd_intf_pins processing_system7_0/M_AXI_GP1]
connect_bd_intf_net [get_bd_intf_pins axi_interconnect_0/M00_AXI] [get_bd_intf_pins DMA_Engine/S_AXI]
connect_bd_intf_net [get_bd_intf_pins M05_AXI] [get_bd_intf_pins axi_interconnect_1/M05_AXI]
connect_bd_intf_net [get_bd_intf_pins M06_AXI] [get_bd_intf_pins axi_interconnect_1/M06_AXI]
connect_bd_intf_net [get_bd_intf_pins M07_AXI] [get_bd_intf_pins axi_interconnect_1/M07_AXI]
connect_bd_intf_net [get_bd_intf_pins M08_AXI] [get_bd_intf_pins axi_interconnect_1/M08_AXI]
connect_bd_intf_net [get_bd_intf_pins M09_AXI] [get_bd_intf_pins axi_interconnect_1/M09_AXI]
connect_bd_intf_net [get_bd_intf_pins M10_AXI] [get_bd_intf_pins axi_interconnect_1/M10_AXI]
connect_bd_intf_net [get_bd_intf_pins M11_AXI] [get_bd_intf_pins axi_interconnect_1/M11_AXI]
connect_bd_intf_net [get_bd_intf_pins M12_AXI] [get_bd_intf_pins axi_interconnect_1/M12_AXI]
connect_bd_intf_net [get_bd_intf_pins M13_AXI] [get_bd_intf_pins axi_interconnect_1/M13_AXI]
connect_bd_intf_net [get_bd_intf_pins M14_AXI] [get_bd_intf_pins axi_interconnect_1/M14_AXI]
connect_bd_intf_net [get_bd_intf_pins M15_AXI] [get_bd_intf_pins axi_interconnect_1/M15_AXI]
connect_bd_intf_net [get_bd_intf_pins M16_AXI] [get_bd_intf_pins axi_interconnect_1/M16_AXI]
connect_bd_intf_net [get_bd_intf_pins M17_AXI] [get_bd_intf_pins axi_interconnect_1/M17_AXI]
connect_bd_intf_net [get_bd_intf_pins M18_AXI] [get_bd_intf_pins axi_interconnect_1/M18_AXI]
connect_bd_intf_net [get_bd_intf_pins M19_AXI] [get_bd_intf_pins axi_interconnect_1/M19_AXI]
connect_bd_intf_net [get_bd_intf_pins M20_AXI] [get_bd_intf_pins axi_interconnect_1/M20_AXI]
connect_bd_intf_net [get_bd_intf_pins M21_AXI] [get_bd_intf_pins axi_interconnect_1/M21_AXI]
connect_bd_intf_net [get_bd_intf_pins M22_AXI] [get_bd_intf_pins axi_interconnect_1/M22_AXI]
connect_bd_intf_net [get_bd_intf_pins M23_AXI] [get_bd_intf_pins axi_interconnect_1/M23_AXI]
connect_bd_intf_net [get_bd_intf_pins DDR] [get_bd_intf_pins processing_system7_0/DDR]
connect_bd_intf_net [get_bd_intf_pins FIXED_IO] [get_bd_intf_pins processing_system7_0/FIXED_IO]
connect_bd_intf_net [get_bd_intf_pins processing_system7_0/M_AXI_GP0] [get_bd_intf_pins axi_interconnect_1/S00_AXI]
connect_bd_net -net S00_ARESETN_1 [get_bd_pins proc_sys_reset_0/peripheral_aresetn] \
  [get_bd_pins peripheral_aresetn] [get_bd_pins axi_interconnect_1/M00_ARESETN] [get_bd_pins axi_interconnect_1/M03_ARESETN] \
  [get_bd_pins axi_interconnect_1/M01_ARESETN] [get_bd_pins axi_interconnect_1/M02_ARESETN] \
  [get_bd_pins axi_interconnect_1/S00_ARESETN] [get_bd_pins axi_interconnect_1/M04_ARESETN] \
  [get_bd_pins DMA_Engine/S00_ARESETN] [get_bd_pins axi_interconnect_0/M00_ARESETN] \
  [get_bd_pins axi_interconnect_0/S00_ARESETN] [get_bd_pins axi_interconnect_1/M06_ARESETN] \
  [get_bd_pins axi_interconnect_1/M05_ARESETN] [get_bd_pins axi_interconnect_1/M07_ARESETN] \
  [get_bd_pins axi_interconnect_1/M08_ARESETN] [get_bd_pins axi_interconnect_1/M09_ARESETN] \
  [get_bd_pins axi_interconnect_1/M10_ARESETN] [get_bd_pins axi_interconnect_1/M11_ARESETN] \
  [get_bd_pins axi_interconnect_1/M12_ARESETN] [get_bd_pins axi_interconnect_1/M13_ARESETN] \
  [get_bd_pins axi_interconnect_1/M14_ARESETN] [get_bd_pins axi_interconnect_0/M01_ARESETN] \
  [get_bd_pins axi_interconnect_1/M15_ARESETN] [get_bd_pins axi_interconnect_1/M16_ARESETN] \
  [get_bd_pins axi_interconnect_1/M17_ARESETN] [get_bd_pins axi_interconnect_1/M18_ARESETN] \
  [get_bd_pins axi_interconnect_1/M19_ARESETN] [get_bd_pins axi_interconnect_1/M20_ARESETN] \
  [get_bd_pins axi_interconnect_1/M21_ARESETN] [get_bd_pins axi_interconnect_1/M22_ARESETN] \
  [get_bd_pins axi_interconnect_1/M23_ARESETN]
connect_bd_net [get_bd_pins m_axi_s2mm_aclk] [get_bd_pins DMA_Engine/m_axi_s2mm_aclk] [get_bd_pins processing_system7_0/S_AXI_HP0_ACLK]
connect_bd_net [get_bd_pins proc_sys_reset_0/interconnect_aresetn] \
  [get_bd_pins axi_interconnect_1/ARESETN] [get_bd_pins DMA_Engine/ARESETN] [get_bd_pins axi_interconnect_0/ARESETN]
connect_bd_net [get_bd_pins processing_system7_0/FCLK_CLK0] \
  [get_bd_pins FCLK_CLK0] [get_bd_pins processing_system7_0/M_AXI_GP1_ACLK] [get_bd_pins axi_interconnect_1/ACLK] \
  [get_bd_pins axi_interconnect_1/S00_ACLK] [get_bd_pins axi_interconnect_1/M00_ACLK] \
  [get_bd_pins axi_interconnect_1/M01_ACLK] [get_bd_pins axi_interconnect_1/M02_ACLK] \
  [get_bd_pins axi_interconnect_1/M03_ACLK] [get_bd_pins processing_system7_0/M_AXI_GP0_ACLK] \
  [get_bd_pins proc_sys_reset_0/slowest_sync_clk] [get_bd_pins axi_interconnect_1/M04_ACLK] \
  [get_bd_pins DMA_Engine/FCLK_CLK0] [get_bd_pins axi_interconnect_0/ACLK] [get_bd_pins axi_interconnect_0/S00_ACLK] \
  [get_bd_pins axi_interconnect_0/M00_ACLK] [get_bd_pins axi_interconnect_1/M05_ACLK] \
  [get_bd_pins axi_interconnect_1/M06_ACLK] [get_bd_pins axi_interconnect_1/M07_ACLK] \
  [get_bd_pins axi_interconnect_1/M08_ACLK] [get_bd_pins axi_interconnect_1/M09_ACLK] \
  [get_bd_pins axi_interconnect_1/M10_ACLK] [get_bd_pins axi_interconnect_1/M11_ACLK] \
  [get_bd_pins axi_interconnect_1/M12_ACLK] [get_bd_pins axi_interconnect_1/M13_ACLK] \
  [get_bd_pins axi_interconnect_1/M14_ACLK] [get_bd_pins axi_interconnect_0/M01_ACLK] \
  [get_bd_pins axi_interconnect_1/M15_ACLK] [get_bd_pins axi_interconnect_1/M16_ACLK] \
  [get_bd_pins axi_interconnect_1/M17_ACLK] [get_bd_pins axi_interconnect_1/M18_ACLK] \
  [get_bd_pins axi_interconnect_1/M19_ACLK] [get_bd_pins axi_interconnect_1/M20_ACLK] \
  [get_bd_pins axi_interconnect_1/M21_ACLK] [get_bd_pins axi_interconnect_1/M22_ACLK] \
  [get_bd_pins axi_interconnect_1/M23_ACLK]
connect_bd_net [get_bd_pins processing_system7_0/FCLK_RESET0_N] [get_bd_pins proc_sys_reset_0/ext_reset_in]

current_bd_instance /PS7/DMA_Engine
connect_bd_intf_net [get_bd_intf_pins S_AXIS_S2MM2] [get_bd_intf_pins axi_dma_0/S_AXIS_S2MM]
connect_bd_intf_net [get_bd_intf_pins axi_dma_0/M_AXI_S2MM] [get_bd_intf_pins axi_interconnect_0/S01_AXI]
connect_bd_intf_net [get_bd_intf_pins M00_AXI] [get_bd_intf_pins axi_interconnect_0/M00_AXI]
connect_bd_intf_net [get_bd_intf_pins axi_interconnect_2/M00_AXI] [get_bd_intf_pins axi_dma_0/S_AXI_LITE]
connect_bd_intf_net [get_bd_intf_pins axi_protocol_convert_0/M_AXI] [get_bd_intf_pins axi_interconnect_2/S00_AXI]
connect_bd_intf_net -intf_net processing_system7_0_M_AXI_GP1 [get_bd_intf_pins S_AXI] [get_bd_intf_pins axi_protocol_convert_0/S_AXI]
connect_bd_net -net ARESETN_1 [get_bd_pins S00_ARESETN] \
  [get_bd_pins axi_interconnect_0/S00_ARESETN] [get_bd_pins axi_interconnect_0/M00_ARESETN] \
  [get_bd_pins axi_interconnect_0/S01_ARESETN] [get_bd_pins axi_interconnect_2/M00_ARESETN] \
  [get_bd_pins axi_interconnect_2/S00_ARESETN] [get_bd_pins axi_dma_0/axi_resetn]
connect_bd_net [get_bd_pins m_axi_s2mm_aclk] \
  [get_bd_pins axi_dma_0/m_axi_s2mm_aclk] [get_bd_pins axi_interconnect_0/ACLK] [get_bd_pins axi_interconnect_0/S00_ACLK] \
  [get_bd_pins axi_interconnect_0/M00_ACLK] [get_bd_pins axi_interconnect_0/S01_ACLK]
connect_bd_net -net processing_system7_0_FCLK_CLK0 [get_bd_pins FCLK_CLK0] \
  [get_bd_pins axi_interconnect_2/S00_ACLK] [get_bd_pins axi_interconnect_2/M00_ACLK] \
  [get_bd_pins axi_protocol_convert_0/aclk] [get_bd_pins axi_dma_0/s_axi_lite_aclk] [get_bd_pins axi_interconnect_2/ACLK]
connect_bd_net -net processing_system7_0_FCLK_RESET0_N [get_bd_pins ARESETN] \
  [get_bd_pins axi_interconnect_2/ARESETN] [get_bd_pins axi_interconnect_0/ARESETN] \
  [get_bd_pins axi_protocol_convert_0/aresetn]

current_bd_instance /PRBS
connect_bd_net [get_bd_pins Clock_Divider_0/DivClock_Out] [get_bd_pins LFSR_0/clock] [get_bd_pins Variable_Delay_0/Clock]
connect_bd_net [get_bd_pins Div_Select] [get_bd_pins Clock_Divider_0/Div_Select]
connect_bd_net -net GPIO_Interface_gpio_io_o1 [get_bd_pins Taps] [get_bd_pins LFSR_0/Taps]
connect_bd_net -net GPIO_Interface_gpio_io_o3 [get_bd_pins Delay_Select] [get_bd_pins Variable_Delay_0/Delay_Select]
connect_bd_net [get_bd_pins LFSR_0/PRBS] [get_bd_pins Reference] [get_bd_pins Variable_Delay_0/D_In]
connect_bd_net [get_bd_pins DivClock_In] [get_bd_pins Clock_Divider_0/DivClock_In]
connect_bd_net -net Squared_Phase_Locked_0_Reset_Out [get_bd_pins Reset] \
  [get_bd_pins LFSR_0/reset] [get_bd_pins Clock_Divider_0/Reset] [get_bd_pins Variable_Delay_0/Reset]
connect_bd_net [get_bd_pins Variable_Delay_0/D_Out] [get_bd_pins Delayed]

current_bd_instance /
connect_bd_intf_net [get_bd_intf_pins DATA_LOGGER_0/s_axis_CH1] [get_bd_intf_pins AXI_Stream_Writer_0/m_axis]
connect_bd_intf_net [get_bd_intf_pins DATA_LOGGER_0/m_axis_S2MMS] [get_bd_intf_pins PS7/S_AXIS_S2MM]
connect_bd_intf_net [get_bd_intf_pins PS7/M00_AXI] [get_bd_intf_pins GPIO_Interface/S_AXI_Kp]
connect_bd_intf_net [get_bd_intf_pins PS7/M03_AXI] [get_bd_intf_pins GPIO_Interface/S_AXI_Ki]
connect_bd_intf_net [get_bd_intf_pins PS7/M05_AXI] [get_bd_intf_pins GPIO_Interface/S_AXI]
connect_bd_intf_net [get_bd_intf_pins PS7/M06_AXI] [get_bd_intf_pins GPIO_Interface/S_AXI1]
connect_bd_intf_net [get_bd_intf_pins PS7/M07_AXI] [get_bd_intf_pins GPIO_Interface/S_AXI2]
connect_bd_intf_net [get_bd_intf_pins PS7/M08_AXI] [get_bd_intf_pins GPIO_Interface/S_AXI_FreqMeasured_B]
connect_bd_intf_net [get_bd_intf_pins PS7/M09_AXI] [get_bd_intf_pins GPIO_Interface/S_AXI3]
connect_bd_intf_net -intf_net PS7_M10_AXI [get_bd_intf_pins PS7/M04_AXI] [get_bd_intf_pins GPIO_Interface/S_AXI_Integrator_Reset]
connect_bd_intf_net [get_bd_intf_pins PS7/M10_AXI] [get_bd_intf_pins GPIO_Interface/S_AXI4]
connect_bd_intf_net [get_bd_intf_pins PS7/M11_AXI] [get_bd_intf_pins GPIO_Interface/S_AXI5]
connect_bd_intf_net [get_bd_intf_pins PS7/M12_AXI] [get_bd_intf_pins GPIO_Interface/S_AXI6]
connect_bd_intf_net [get_bd_intf_pins PS7/M13_AXI] [get_bd_intf_pins GPIO_Interface/S_AXI7]
connect_bd_intf_net [get_bd_intf_pins PS7/M14_AXI] [get_bd_intf_pins GPIO_Interface/S_AXI8]
connect_bd_intf_net [get_bd_intf_pins PS7/M15_AXI] [get_bd_intf_pins GPIO_Interface/S_AXI9]
connect_bd_intf_net [get_bd_intf_pins PS7/M16_AXI] [get_bd_intf_pins GPIO_Interface/S_AXI10]
connect_bd_intf_net [get_bd_intf_pins PS7/M17_AXI] [get_bd_intf_pins GPIO_Interface/S_AXI11]
connect_bd_intf_net [get_bd_intf_pins PS7/M18_AXI] [get_bd_intf_pins GPIO_Interface/S_AXI12]
connect_bd_intf_net [get_bd_intf_pins PS7/M19_AXI] [get_bd_intf_pins GPIO_Interface/S_AXI13]
connect_bd_intf_net [get_bd_intf_pins PS7/M20_AXI] [get_bd_intf_pins GPIO_Interface/S_AXI14]
connect_bd_intf_net [get_bd_intf_pins PS7/M21_AXI] [get_bd_intf_pins GPIO_Interface/S_AXI15]
connect_bd_intf_net [get_bd_intf_pins PS7/M22_AXI] [get_bd_intf_pins GPIO_Interface/S_AXI16]
connect_bd_intf_net [get_bd_intf_pins PS7/M23_AXI] [get_bd_intf_pins GPIO_Interface/S_AXI17]
connect_bd_intf_net -intf_net S_AXI6_1 [get_bd_intf_pins GPIO_Interface/S_AXI_PLL_Guess] [get_bd_intf_pins PS7/M01_AXI]
connect_bd_intf_net -intf_net S_AXI7_1 [get_bd_intf_pins GPIO_Interface/S_AXI_FreqMeasured] [get_bd_intf_pins PS7/M02_AXI]
connect_bd_intf_net [get_bd_intf_pins axis_red_pitaya_adc_0/M_AXIS] [get_bd_intf_pins DMA_Interconnect_0/ADC_s_axis]
connect_bd_intf_net -intf_net processing_system7_0_DDR [get_bd_intf_ports DDR] [get_bd_intf_pins PS7/DDR]
connect_bd_intf_net -intf_net processing_system7_0_FIXED_IO [get_bd_intf_ports FIXED_IO] [get_bd_intf_pins PS7/FIXED_IO]
connect_bd_net [get_bd_pins Costa_Demodulator_0/Freq_Measured] [get_bd_pins GPIO_Interface/gpio_Freq_Measured] [get_bd_pins Subtractor_0/Dplus]
connect_bd_net [get_bd_pins Costa_Demodulator_0/Message] [get_bd_pins DMA_Interconnect_0/Demodulated_PRBS]
connect_bd_net [get_bd_pins Costa_Demodulator_1/Freq_Measured] [get_bd_pins GPIO_Interface/FMeasuredB] [get_bd_pins Subtractor_0/Dminus]
connect_bd_net [get_bd_pins Costa_Demodulator_1/Message] [get_bd_pins DMA_Interconnect_0/Demodulated_PRBS_B]
connect_bd_net [get_bd_pins DATA_LOGGER_0/trigger] [get_bd_pins GPIO_Interface/gpio_io_i1]
connect_bd_net [get_bd_pins DMA_Interconnect_0/ADC_C1] [get_bd_pins Costa_Demodulator_0/Input_Signal] [get_bd_pins Costa_Demodulator_1/Input_Signal]
connect_bd_net -net Delay_Select_1 [get_bd_pins GPIO_Interface/gpio_PRBS_Delay] [get_bd_pins PRBS/Delay_Select]
connect_bd_net -net Div_Select_1 [get_bd_pins GPIO_Interface/gpio_PRBS_Div] [get_bd_pins PRBS/Div_Select]
connect_bd_net [get_bd_pins GPIO_Interface/gpio_Ki] [get_bd_pins Costa_Demodulator_0/Control_Ki]
connect_bd_net [get_bd_pins GPIO_Interface/gpio_KiB] [get_bd_pins Costa_Demodulator_1/Control_Ki]
connect_bd_net [get_bd_pins GPIO_Interface/gpio_Kp] [get_bd_pins Costa_Demodulator_0/Control_Kp]
connect_bd_net [get_bd_pins GPIO_Interface/gpio_KpB] [get_bd_pins Costa_Demodulator_1/Control_Kp]
connect_bd_net -net GPIO_Interface_gpio_io_o [get_bd_pins GPIO_Interface/gpio_PRBS_Scale] [get_bd_pins PRBS_Multiply_0/Scale]
connect_bd_net [get_bd_pins GPIO_Interface/gpio_io_o] [get_bd_pins Test_Pattern_Gen_0/Reset]
connect_bd_net [get_bd_pins GPIO_Interface/gpio_io_o1] [get_bd_pins DATA_LOGGER_0/down_sample]
connect_bd_net [get_bd_pins GPIO_Interface/gpio_io_o2] [get_bd_pins Costa_Demodulator_0/Control_Kii]
connect_bd_net [get_bd_pins GPIO_Interface/gpio_io_o3] [get_bd_pins Costa_Demodulator_1/Control_Kii]
connect_bd_net [get_bd_pins GPIO_Interface/gpio_io_o4] [get_bd_pins Costa_Demodulator_0/Control_fKi]
connect_bd_net [get_bd_pins GPIO_Interface/gpio_io_o5] [get_bd_pins Costa_Demodulator_1/Control_fKi]
connect_bd_net [get_bd_pins GPIO_Interface/gpio_io_o6] [get_bd_pins Costa_Demodulator_0/Control_fKii]
connect_bd_net [get_bd_pins GPIO_Interface/gpio_io_o7] [get_bd_pins Costa_Demodulator_1/Control_fKii]
connect_bd_net [get_bd_pins GPIO_Interface/gpio_io_o8] [get_bd_pins Costa_Demodulator_1/Control_fKp]
connect_bd_net [get_bd_pins GPIO_Interface/gpio_io_o9] [get_bd_pins Costa_Demodulator_0/Control_fKp]
connect_bd_net -net Input_C2_1 [get_bd_pins Costa_Demodulator_0/Locked_Carrier] [get_bd_pins DAC_Interface/Input_C2]
connect_bd_net [get_bd_pins NCO_Wrapper_0/Dout] [get_bd_pins DAC_Interface/Input_C1]
connect_bd_net [get_bd_pins axis_red_pitaya_adc_0/adc_clk] \
  [get_bd_pins DAC_Interface/aclk] [get_bd_pins PS7/m_axi_s2mm_aclk] [get_bd_pins PRBS/DivClock_In] \
  [get_bd_pins DMA_Interconnect_0/aclk] [get_bd_pins PRBS_Multiply_0/Clock] [get_bd_pins Reset_Gen_0/Clock] \
  [get_bd_pins Test_Pattern_Gen_0/Clock] [get_bd_pins DATA_LOGGER_0/m_axis_aclk] [get_bd_pins DATA_LOGGER_0/s_axis_aclk] \
  [get_bd_pins Costa_Demodulator_0/Clock] [get_bd_pins Costa_Demodulator_1/Clock] [get_bd_pins Subtractor_0/clock] \
  [get_bd_pins NCO_Wrapper_0/clock]
connect_bd_net [get_bd_pins GPIO_Interface/gpio_PLL_Guess_Freq] \
  [get_bd_pins Costa_Demodulator_0/PLL_Guess_Freq] [get_bd_pins Costa_Demodulator_1/PLL_Guess_Freq]
connect_bd_net [get_bd_pins GPIO_Interface/gpio_Integrator_Reset] \
  [get_bd_pins Costa_Demodulator_0/Integrator_Reset] [get_bd_pins Costa_Demodulator_1/Integrator_Reset]
connect_bd_net [get_bd_pins xlconstant_1/dout] [get_bd_pins Costa_Demodulator_0/Threshold] [get_bd_pins Costa_Demodulator_1/Threshold]
connect_bd_net [get_bd_pins Reset_Gen_0/Reset] \
  [get_bd_pins PRBS/Reset] [get_bd_pins DATA_LOGGER_0/rst] [get_bd_pins Costa_Demodulator_0/Reset] \
  [get_bd_pins Costa_Demodulator_1/Reset] [get_bd_pins NCO_Wrapper_0/rst]
connect_bd_net [get_bd_pins PRBS/Delayed] [get_bd_pins PRBS_Multiply_0/PRBS]
connect_bd_net [get_bd_pins PRBS/Reference] [get_bd_pins DMA_Interconnect_0/Reference_PRBS]
connect_bd_net [get_bd_pins PS7/FCLK_CLK0] [get_bd_pins GPIO_Interface/s_axi_aclk]
connect_bd_net [get_bd_pins PS7/peripheral_aresetn] [get_bd_pins GPIO_Interface/s_axi_aresetn]
connect_bd_net [get_bd_pins Subtractor_0/Q] [get_bd_pins AXI_Stream_Writer_0/D_In]
connect_bd_net -net Taps_1 [get_bd_pins GPIO_Interface/gpio_Taps] [get_bd_pins PRBS/Taps]
connect_bd_net [get_bd_ports adc_clk_n_i] [get_bd_pins axis_red_pitaya_adc_0/adc_clk_n]
connect_bd_net [get_bd_ports adc_clk_p_i] [get_bd_pins axis_red_pitaya_adc_0/adc_clk_p]
connect_bd_net [get_bd_ports adc_dat_a_i] [get_bd_pins axis_red_pitaya_adc_0/adc_dat_a]
connect_bd_net [get_bd_ports adc_dat_b_i] [get_bd_pins axis_red_pitaya_adc_0/adc_dat_b]
connect_bd_net [get_bd_pins axis_red_pitaya_adc_0/adc_csn] [get_bd_ports adc_csn_o]
connect_bd_net -net axis_red_pitaya_dac_1_dac_clk [get_bd_pins DAC_Interface/dac_clk_o] [get_bd_ports dac_clk_o]
connect_bd_net -net axis_red_pitaya_dac_1_dac_dat [get_bd_pins DAC_Interface/dac_dat_o] [get_bd_ports dac_dat_o]
connect_bd_net -net axis_red_pitaya_dac_1_dac_rst [get_bd_pins DAC_Interface/dac_rst_o] [get_bd_ports dac_rst_o]
connect_bd_net -net axis_red_pitaya_dac_1_dac_sel [get_bd_pins DAC_Interface/dac_sel_o] [get_bd_ports dac_sel_o]
connect_bd_net -net axis_red_pitaya_dac_1_dac_wrt [get_bd_pins DAC_Interface/dac_wrt_o] [get_bd_ports dac_wrt_o]
# net daisy_n_i_1 has one end: daisy_n_i
# net daisy_p_i_1 has one end: daisy_p_i
connect_bd_net [get_bd_pins xlconstant_0/dout] [get_bd_pins NCO_Wrapper_0/Frequency]

# ---- address map ----
assign_bd_address -offset 0x00000000 -range 512M -target_address_space [get_bd_addr_spaces PS7/DMA_Engine/axi_dma_0/Data_S2MM] [get_bd_addr_segs PS7/processing_system7_0/S_AXI_HP0/HP0_DDR_LOWOCM]
assign_bd_address -offset 0x41200000 -range 64K -target_address_space [get_bd_addr_spaces PS7/processing_system7_0/Data] [get_bd_addr_segs GPIO_Interface/GPIO_FreqMeasureA/S_AXI/Reg]
assign_bd_address -offset 0x41210000 -range 64K -target_address_space [get_bd_addr_spaces PS7/processing_system7_0/Data] [get_bd_addr_segs GPIO_Interface/GPIO_PLL_GUESS_Freq/S_AXI/Reg]
assign_bd_address -offset 0x41220000 -range 64K -target_address_space [get_bd_addr_spaces PS7/processing_system7_0/Data] [get_bd_addr_segs GPIO_Interface/GPIO_Kp/S_AXI/Reg]
assign_bd_address -offset 0x41230000 -range 64K -target_address_space [get_bd_addr_spaces PS7/processing_system7_0/Data] [get_bd_addr_segs GPIO_Interface/GPIO_Ki/S_AXI/Reg]
assign_bd_address -offset 0x41240000 -range 64K -target_address_space [get_bd_addr_spaces PS7/processing_system7_0/Data] [get_bd_addr_segs GPIO_Interface/GPIO_Integrator_Reset/S_AXI/Reg]
assign_bd_address -offset 0x41250000 -range 64K -target_address_space [get_bd_addr_spaces PS7/processing_system7_0/Data] [get_bd_addr_segs GPIO_Interface/GPIO_KiB/S_AXI/Reg]
assign_bd_address -offset 0x41260000 -range 64K -target_address_space [get_bd_addr_spaces PS7/processing_system7_0/Data] [get_bd_addr_segs GPIO_Interface/GPIO_KpB/S_AXI/Reg]
assign_bd_address -offset 0x41270000 -range 64K -target_address_space [get_bd_addr_spaces PS7/processing_system7_0/Data] [get_bd_addr_segs GPIO_Interface/GPIO_PRBS_Delay/S_AXI/Reg]
assign_bd_address -offset 0x41280000 -range 64K -target_address_space [get_bd_addr_spaces PS7/processing_system7_0/Data] [get_bd_addr_segs GPIO_Interface/GPIO_FreqMeasureB/S_AXI/Reg]
assign_bd_address -offset 0x41290000 -range 64K -target_address_space [get_bd_addr_spaces PS7/processing_system7_0/Data] [get_bd_addr_segs GPIO_Interface/GPIO_PRBS_DIV/S_AXI/Reg]
assign_bd_address -offset 0x412A0000 -range 64K -target_address_space [get_bd_addr_spaces PS7/processing_system7_0/Data] [get_bd_addr_segs GPIO_Interface/GPIO_PRBS_Scale/S_AXI/Reg]
assign_bd_address -offset 0x412B0000 -range 64K -target_address_space [get_bd_addr_spaces PS7/processing_system7_0/Data] [get_bd_addr_segs GPIO_Interface/GPIO_Samping_Div/S_AXI/Reg]
assign_bd_address -offset 0x412C0000 -range 64K -target_address_space [get_bd_addr_spaces PS7/processing_system7_0/Data] [get_bd_addr_segs GPIO_Interface/GPIO_Taps/S_AXI/Reg]
assign_bd_address -offset 0x412D0000 -range 64K -target_address_space [get_bd_addr_spaces PS7/processing_system7_0/Data] [get_bd_addr_segs GPIO_Interface/GPIO_LoggerStatus/S_AXI/Reg]
assign_bd_address -offset 0x412E0000 -range 64K -target_address_space [get_bd_addr_spaces PS7/processing_system7_0/Data] [get_bd_addr_segs GPIO_Interface/GPIO_SamplingReset/S_AXI/Reg]
assign_bd_address -offset 0x412F0000 -range 64K -target_address_space [get_bd_addr_spaces PS7/processing_system7_0/Data] [get_bd_addr_segs GPIO_Interface/GPIO_LoggerStatus1/S_AXI/Reg]
assign_bd_address -offset 0x41300000 -range 64K -target_address_space [get_bd_addr_spaces PS7/processing_system7_0/Data] [get_bd_addr_segs GPIO_Interface/GPIO_fKi/S_AXI/Reg]
assign_bd_address -offset 0x41310000 -range 64K -target_address_space [get_bd_addr_spaces PS7/processing_system7_0/Data] [get_bd_addr_segs GPIO_Interface/GPIO_fKiB/S_AXI/Reg]
assign_bd_address -offset 0x41320000 -range 64K -target_address_space [get_bd_addr_spaces PS7/processing_system7_0/Data] [get_bd_addr_segs GPIO_Interface/GPIO_fKii/S_AXI/Reg]
assign_bd_address -offset 0x41330000 -range 64K -target_address_space [get_bd_addr_spaces PS7/processing_system7_0/Data] [get_bd_addr_segs GPIO_Interface/GPIO_fKiiB/S_AXI/Reg]
assign_bd_address -offset 0x41340000 -range 64K -target_address_space [get_bd_addr_spaces PS7/processing_system7_0/Data] [get_bd_addr_segs GPIO_Interface/GPIO_fKp/S_AXI/Reg]
assign_bd_address -offset 0x41350000 -range 64K -target_address_space [get_bd_addr_spaces PS7/processing_system7_0/Data] [get_bd_addr_segs GPIO_Interface/GPIO_fKpB/S_AXI/Reg]
assign_bd_address -offset 0x41360000 -range 64K -target_address_space [get_bd_addr_spaces PS7/processing_system7_0/Data] [get_bd_addr_segs GPIO_Interface/GPIO_Kii/S_AXI/Reg]
assign_bd_address -offset 0x41370000 -range 64K -target_address_space [get_bd_addr_spaces PS7/processing_system7_0/Data] [get_bd_addr_segs GPIO_Interface/GPIO_KiiB/S_AXI/Reg]
assign_bd_address -offset 0x80400000 -range 64K -target_address_space [get_bd_addr_spaces PS7/processing_system7_0/Data] [get_bd_addr_segs PS7/DMA_Engine/axi_dma_0/S_AXI_LITE/Reg]

validate_bd_design
save_bd_design
